# Altium schematic sheet Bandpass.SchDoc: Bandpass
size A4; Author: Andreas Rehn; CompanyName: Hochschule Ulm; Engineer: Andreas Rehn; Organization: Hochschule Ulm; Address1: Institut für Medizintechnik; Address2: und Mechatronik; Address3: Albert-Einstein-Allee 55; Address4: 89081 Ulm; SheetNumber: 4; SheetTotal: 11
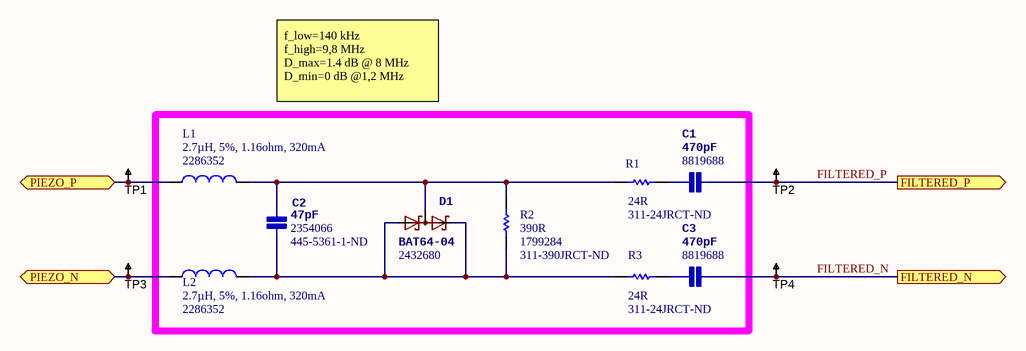
[diagram p0: Bandpass.SchDoc]

## Parts
C1  470pF  Supplier Part Number 1: 8819688  [0402[1005]]
C2  47pF  Supplier Part Number 1: 445-5361-1-ND  Supplier Part Number 2: 2354066  [0402[1005]]
C3  470pF  Supplier Part Number 1: 8819688  [0402[1005]]
D1  BAT64-04  Supplier Part Number 1: 2432680  [SOT23-3]
L1  2.7µH, 5%, 1.16ohm, 320mA  Supplier Part Number 1: 2286352  [WE0805]
L2  2.7µH, 5%, 1.16ohm, 320mA  Supplier Part Number 1: 2286352  [WE0805]
R1  24R  Supplier Part Number 1: 311-24JRCT-ND  [0402[1005]]
R2  390R  Supplier Part Number 1: 1799284  Supplier Part Number 2: 311-390JRCT-ND  [0402[1005]]
R3  24R  Supplier Part Number 1: 311-24JRCT-ND  [0402[1005]]
TP1  TESTPOINT_THT_MINI  [TP-THT-MINI]  (value not drawn)
TP2  TESTPOINT_THT_MINI  [TP-THT-MINI]  (value not drawn)
TP3  TESTPOINT_THT_MINI  [TP-THT-MINI]  (value not drawn)
TP4  TESTPOINT_THT_MINI  [TP-THT-MINI]  (value not drawn)

## Ports
FILTERED_N, FILTERED_P, PIEZO_N, PIEZO_P

## Nets
FILTERED_N: C3.2(P$2) TP4.1 ; port FILTERED_N
FILTERED_P: C1.2(P$2) TP2.1 ; port FILTERED_P
PIEZO_N: L2.1 TP3.1 ; port PIEZO_N
PIEZO_P: L1.1 TP1.1 ; port PIEZO_P
NetC1_1: C1.1(P$1) R1.2
NetC2_1: C2.1(P$1) D1.3(C1A2) L1.2 R1.1 R2.1
NetC2_2: C2.2(P$2) D1.1(A1) D1.2(C2) L2.2 R2.2 R3.1
NetC3_1: C3.1(P$1) R3.2

## Notes on the sheet
- f_low=140 kHz
  f_high=9,8 MHz
  D_max=1.4 dB @ 8 MHz
  D_min=0 dB @1,2 MHz
- Project
- Ultrasonic Doppler 2015
- Title
- Size:
- Date:
- A4
- Number:
- Time:
- Revision:
- Sheet
- of
- Eng:

## Library data of the parts
C1-C3 = Capacitor: Cap
  C1 C3: value: 470pF; Supplier 1: Farnell
  C2: value: 47pF; Supplier 1: Digi-Key; Supplier 2: Farnell
D1 = BAT64-04: Silicon Schottky Diodes; value: BAT64-04; DataSheet: http://www.farnell.com/datasheets/1836110.pdf; Supplier 1: Farnell
L1 L2 = Inductor: Code_IEC: 1005; Published: 8-Jun-2000; LatestRevisionDate: 29-May-2009; LatestRevisionNote: IPC-7351 Footprint Added.; PackageReference: 0402-A; Publisher: Altium Limited; PackageDescription: Chip Inductor; Code_JEITA: 0402; Value: 2.7µH, 5%, 1.16ohm, 320mA; Supplier 1: Farnell
R1-R3 = Resistor: Published: 8-Jun-2000; LatestRevisionDate: 17-Jul-2002; LatestRevisionNote: Re-released for DXP Platform.; PackageReference: AXIAL-0.3; Publisher: Altium Limited; PackageDescription: Axial Device, Thru-Hole; 2 Leads; 0.3 in Pin Spacing
  R1 R3: Value: 24R; Supplier 1: Digi-Key
  R2: Value: 390R; Supplier 1: Farnell; Supplier 2: Digi-Key
TP1-TP4 = TESTPOINT_THT_MINI: Test Point PCB mount Miniature White; PBL Part Number: 3100-567; Manufacturer 1: Keystone Electronics; Manufacturer Part Number 1: 5002; Mounting Type: 0.040" (1.0mm) Hole Diameter; Material: Base, Nylon 46, UL 94V-0; Supplier 1: Digi-Key; Supplier Part Number 1: 5002K-ND